# Altium schematic sheet Top_Sheet.SchDoc
size 420 x 297 mm; SheetNumber: 1; SheetTotal: 10
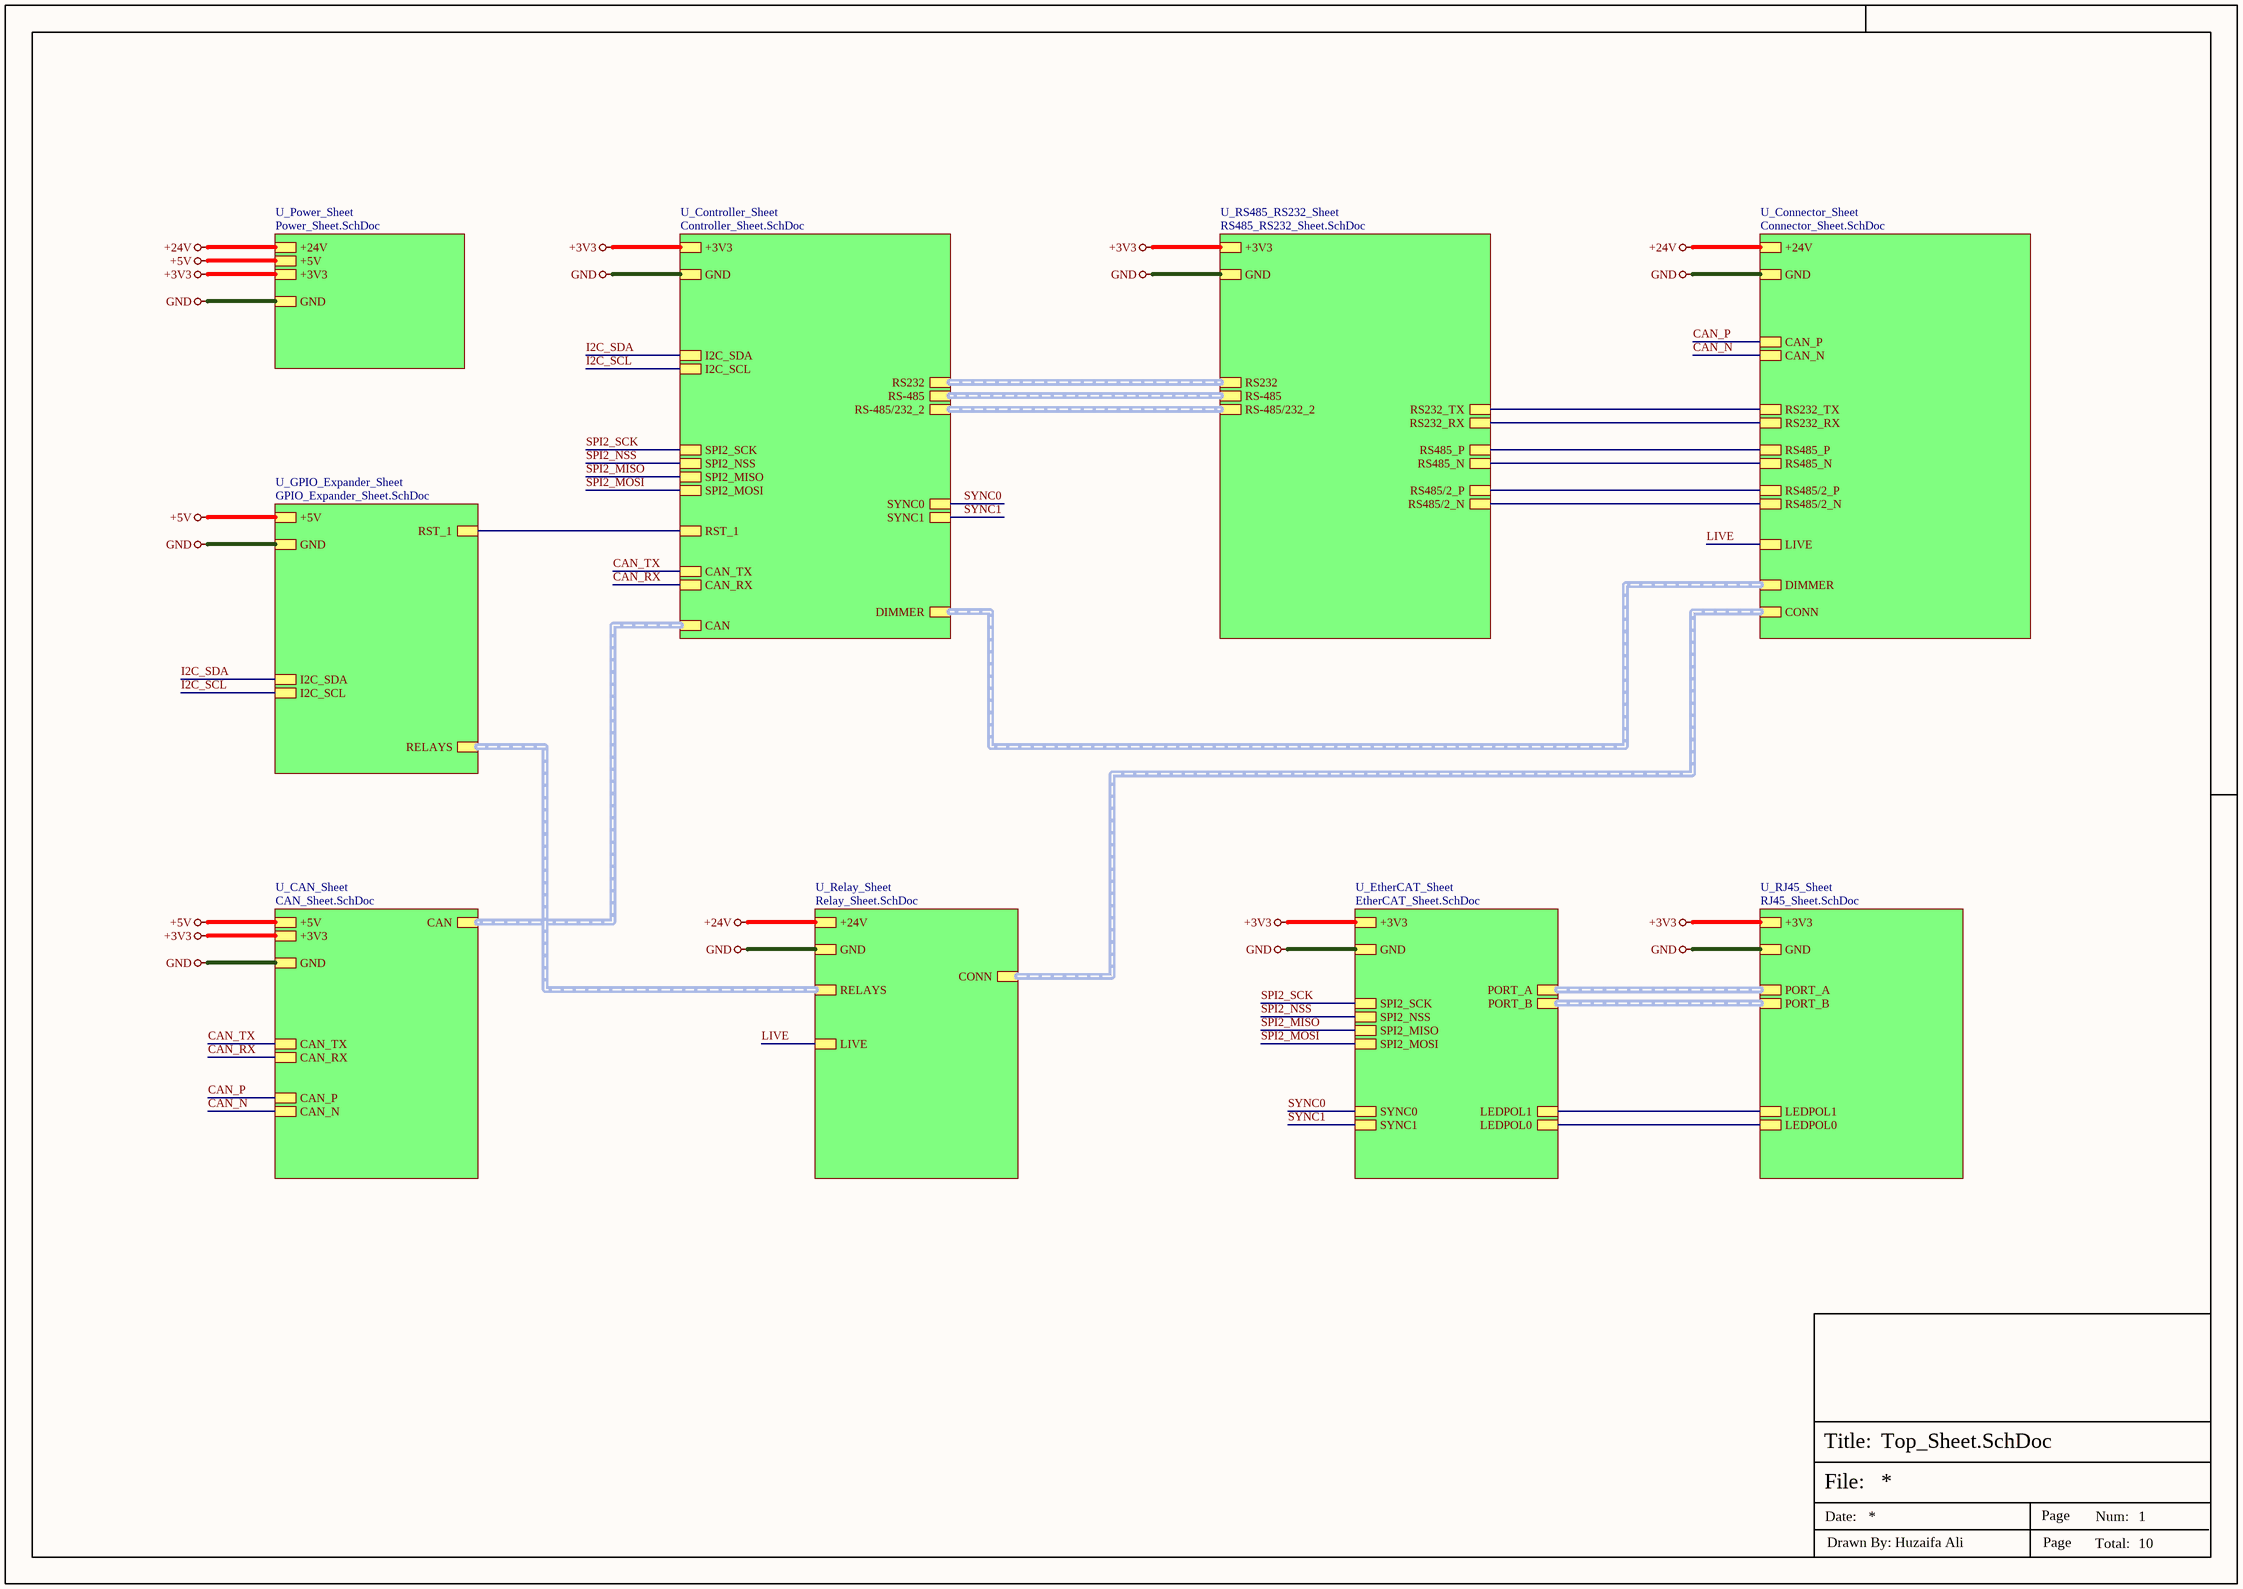
[diagram p0: Top_Sheet.SchDoc]

## Sub-sheets
U_CAN_Sheet = CAN_Sheet.SchDoc: CAN (harness CAN), CAN_RX, CAN_TX, CAN_P, CAN_N, +5V, +3V3, GND
U_Connector_Sheet = Connector_Sheet.SchDoc: RS485/2_N, RS485/2_P, RS485_N, RS485_P, RS232_RX, RS232_TX, CAN_P, CAN_N, GND, +24V, CONN (harness CONN), LIVE, DIMMER (harness RELAYS)
U_Controller_Sheet = Controller_Sheet.SchDoc: SPI2_SCK, SPI2_NSS, SPI2_MISO, SPI2_MOSI, RS-485/232_2 (harness RS-485/232_2), RS232 (harness RS232), +3V3, GND, RS-485 (harness RS-485), CAN_RX, CAN_TX, CAN (harness CAN), SYNC0, SYNC1, RST_1, I2C_SDA, I2C_SCL, DIMMER (harness RELAYS)
U_EtherCAT_Sheet = EtherCAT_Sheet.SchDoc: PORT_A (harness PORT_A), PORT_B (harness PORT_B), LEDPOL0, LEDPOL1, SPI2_SCK, SPI2_NSS, SPI2_MISO, SPI2_MOSI, +3V3, GND, SYNC0, SYNC1
U_GPIO_Expander_Sheet = GPIO_Expander_Sheet.SchDoc: RST_1, RELAYS (harness RELAYS), +5V, GND, I2C_SDA, I2C_SCL
U_Power_Sheet = Power_Sheet.SchDoc: +5V, +3V3, GND, +24V
U_Relay_Sheet = Relay_Sheet.SchDoc: RELAYS (harness RELAYS), CONN (harness CONN), GND, +24V, LIVE
U_RJ45_Sheet = RJ45_Sheet.SchDoc: PORT_A (harness PORT_A), PORT_B (harness PORT_B), LEDPOL0, LEDPOL1, +3V3, GND
U_RS485_RS232_Sheet = RS485_RS232_Sheet.SchDoc: RS485_N, RS485_P, RS232_RX, RS232_TX, RS-485 (harness RS-485), +3V3, GND, RS485/2_N, RS485/2_P, RS-485/232_2 (harness RS-485/232_2), RS232 (harness RS232)

## Nets
+3V3: sheet U_CAN_Sheet/+3V3, sheet U_Controller_Sheet/+3V3, sheet U_EtherCAT_Sheet/+3V3, sheet U_Power_Sheet/+3V3, sheet U_RJ45_Sheet/+3V3, sheet U_RS485_RS232_Sheet/+3V3
+5V: sheet U_CAN_Sheet/+5V, sheet U_Power_Sheet/+5V, sheet U_GPIO_Expander_Sheet/+5V
+24V: sheet U_Connector_Sheet/+24V, sheet U_Power_Sheet/+24V, sheet U_Relay_Sheet/+24V
GND: sheet U_CAN_Sheet/GND, sheet U_Connector_Sheet/GND, sheet U_Controller_Sheet/GND, sheet U_EtherCAT_Sheet/GND, sheet U_Power_Sheet/GND, sheet U_Relay_Sheet/GND, sheet U_RJ45_Sheet/GND, sheet U_RS485_RS232_Sheet/GND, sheet U_GPIO_Expander_Sheet/GND
CAN_N: sheet U_CAN_Sheet/CAN_N, sheet U_Connector_Sheet/CAN_N
CAN_P: sheet U_CAN_Sheet/CAN_P, sheet U_Connector_Sheet/CAN_P
CAN_RX: sheet U_CAN_Sheet/CAN_RX, sheet U_Controller_Sheet/CAN_RX
CAN_TX: sheet U_CAN_Sheet/CAN_TX, sheet U_Controller_Sheet/CAN_TX
I2C_SCL: sheet U_Controller_Sheet/I2C_SCL, sheet U_GPIO_Expander_Sheet/I2C_SCL
I2C_SDA: sheet U_Controller_Sheet/I2C_SDA, sheet U_GPIO_Expander_Sheet/I2C_SDA
LIVE: sheet U_Connector_Sheet/LIVE, sheet U_Relay_Sheet/LIVE
SPI2_MISO: sheet U_Controller_Sheet/SPI2_MISO, sheet U_EtherCAT_Sheet/SPI2_MISO
SPI2_MOSI: sheet U_Controller_Sheet/SPI2_MOSI, sheet U_EtherCAT_Sheet/SPI2_MOSI
SPI2_NSS: sheet U_Controller_Sheet/SPI2_NSS, sheet U_EtherCAT_Sheet/SPI2_NSS
SPI2_SCK: sheet U_Controller_Sheet/SPI2_SCK, sheet U_EtherCAT_Sheet/SPI2_SCK
SYNC0: sheet U_Controller_Sheet/SYNC0, sheet U_EtherCAT_Sheet/SYNC0
SYNC1: sheet U_Controller_Sheet/SYNC1, sheet U_EtherCAT_Sheet/SYNC1
(unnamed): sheet U_Connector_Sheet/RS485/2_N, sheet U_RS485_RS232_Sheet/RS485/2_N
(unnamed): sheet U_Connector_Sheet/RS485/2_P, sheet U_RS485_RS232_Sheet/RS485/2_P
(unnamed): sheet U_Connector_Sheet/RS485_N, sheet U_RS485_RS232_Sheet/RS485_N
(unnamed): sheet U_Connector_Sheet/RS485_P, sheet U_RS485_RS232_Sheet/RS485_P
(unnamed): sheet U_Connector_Sheet/RS232_RX, sheet U_RS485_RS232_Sheet/RS232_RX
(unnamed): sheet U_Connector_Sheet/RS232_TX, sheet U_RS485_RS232_Sheet/RS232_TX
(unnamed): sheet U_Controller_Sheet/RST_1, sheet U_GPIO_Expander_Sheet/RST_1
(unnamed): sheet U_EtherCAT_Sheet/LEDPOL0, sheet U_RJ45_Sheet/LEDPOL0
(unnamed): sheet U_EtherCAT_Sheet/LEDPOL1, sheet U_RJ45_Sheet/LEDPOL1

## Buses and harness runs
harness sheet U_CAN_Sheet/CAN = sheet U_Controller_Sheet/CAN
harness sheet U_Connector_Sheet/CONN = sheet U_Relay_Sheet/CONN
harness sheet U_Connector_Sheet/DIMMER = sheet U_Controller_Sheet/DIMMER
harness sheet U_Controller_Sheet/RS232 = sheet U_RS485_RS232_Sheet/RS232
harness sheet U_Controller_Sheet/RS-485 = sheet U_RS485_RS232_Sheet/RS-485
harness sheet U_Controller_Sheet/RS-485/232_2 = sheet U_RS485_RS232_Sheet/RS-485/232_2
harness sheet U_EtherCAT_Sheet/PORT_A = sheet U_RJ45_Sheet/PORT_A
harness sheet U_EtherCAT_Sheet/PORT_B = sheet U_RJ45_Sheet/PORT_B
harness sheet U_GPIO_Expander_Sheet/RELAYS = sheet U_Relay_Sheet/RELAYS

## Notes on the sheet
- File:
- Title:
- Date:
- Page
- Num:
- Total:
- Drawn By: Huzaifa Ali